# EAGLE design esp8285-router (EAGLE 8.3.2)
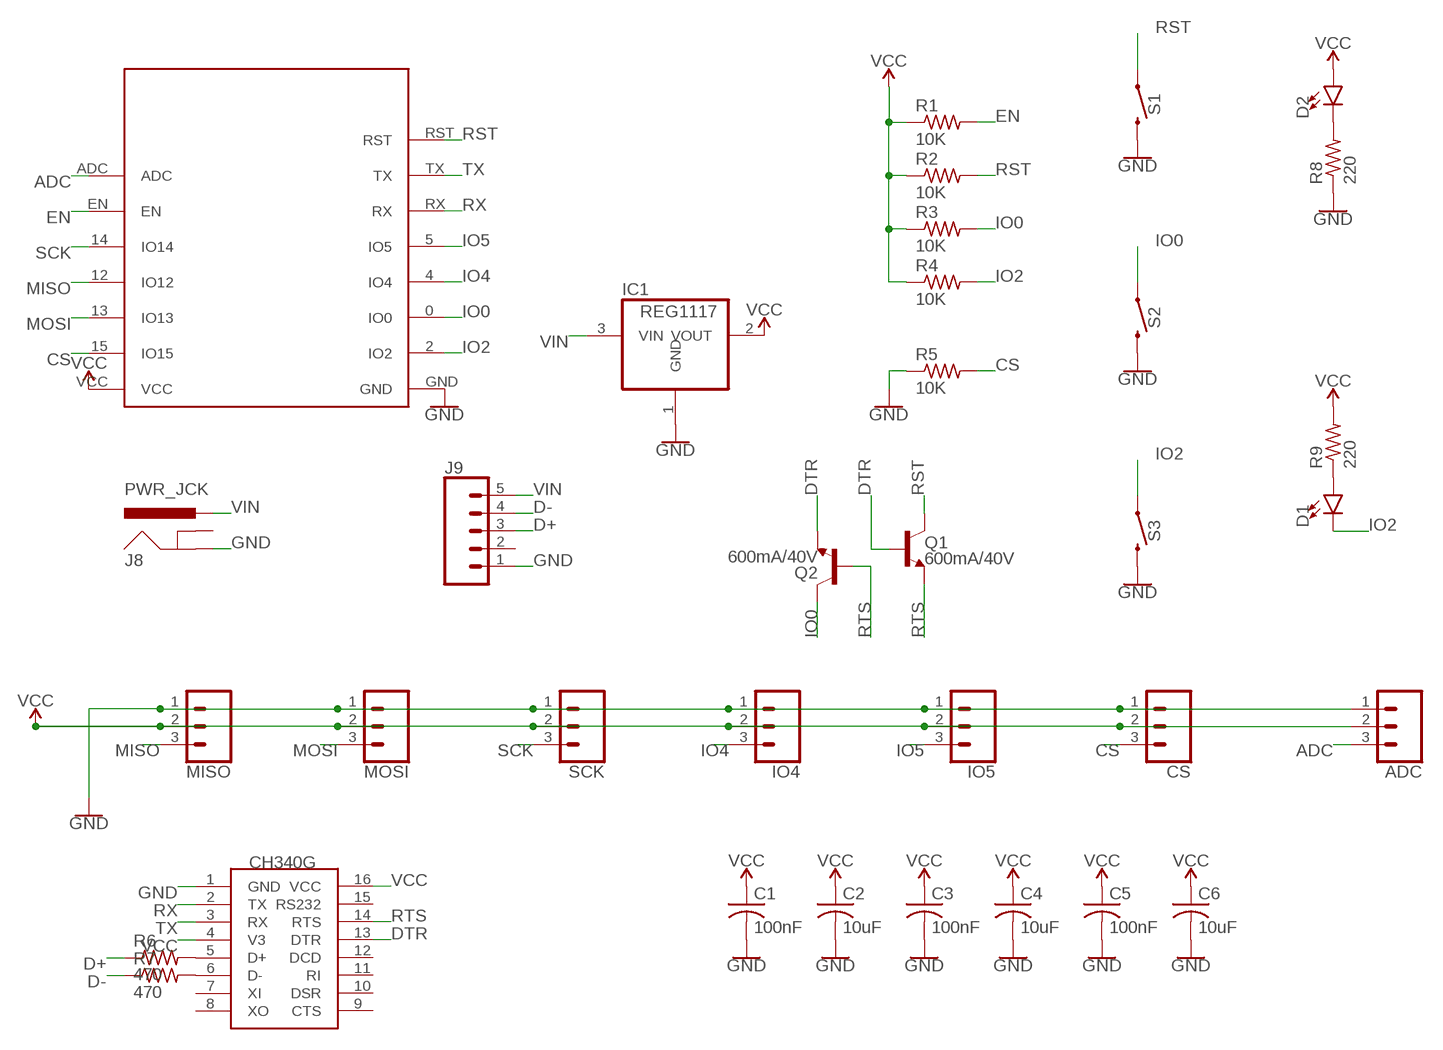
[diagram p0: schematic, sheet 1]

## Parts
ADC  CONN_03  [1X03]
C1  100nF  C-USC1206  [C1206]
C2  10uF  C-USC1206  [C1206]
C3  100nF  C-USC1206  [C1206]
C4  10uF  C-USC1206  [C1206]
C5  100nF  C-USC1206  [C1206]
C6  10uF  C-USC1206  [C1206]
CH340C  CH340C  CH340G  [SOIC16]
CS  CONN_03  [1X03]
D1  LED1206  [LED-1206]
D2  LED1206  [LED-1206]
IC1  REG1117  [SOT223]
IO4  CONN_03  [1X03]
IO5  CONN_03  [1X03]
J8  PWR_JCK  POWER_JACKSLT  [POWER_JACK_SLOT]
J9  CONN_05  [1X05]
MISO  CONN_03  [1X03]
MOSI  CONN_03  [1X03]
Q1  600mA/40V  TRANS_NPN-MMBT2222AL  [SOT23-3]
Q2  600mA/40V  TRANS_NPN-MMBT2222AL  [SOT23-3]
R1  10K  R-US_R1206  [R1206]
R2  10K  R-US_R1206  [R1206]
R3  10K  R-US_R1206  [R1206]
R4  10K  R-US_R1206  [R1206]
R5  10K  R-US_R1206  [R1206]
R6  470  R-US_R1206  [R1206]
R7  470  R-US_R1206  [R1206]
R8  220  R-US_R1206  [R1206]
R9  220  R-US_R1206  [R1206]
S1  MOMENTARY-SWITCH-SPST-PTH-6.0MM  [TACTILE_SWITCH_PTH_6.0MM]
S2  MOMENTARY-SWITCH-SPST-PTH-6.0MM  [TACTILE_SWITCH_PTH_6.0MM]
S3  MOMENTARY-SWITCH-SPST-PTH-6.0MM  [TACTILE_SWITCH_PTH_6.0MM]
SCK  CONN_03  [1X03]
U$1  ESP-M2  [ESP-M2]

## Nets
ADC: ADC.3 U$1.ADC
CS: CS.3 R5.2 U$1.15(IO15)
D+: J9.3 R6.1
D-: J9.4 R7.1
DTR: CH340C.13(DTR) Q1.1(B) Q2.2(E)
EN: R1.2 U$1.EN
GND: ADC.1 C1.2 C2.2 C3.2 C4.2 C5.2 C6.2 CH340C.1(GND) CS.1 IC1.1(GND) IO4.1 IO5.1 J8.GND@2(GND) J9.1 MISO.1 MOSI.1 R5.1 R8.1 S1.3 S2.3 S3.3 SCK.1 U$1.GND
IO0: Q2.3(C) R3.2 S2.1 U$1.0(IO0)
IO2: D1.C R4.2 S3.1 U$1.2(IO2)
IO4: IO4.3 U$1.4(IO4)
IO5: IO5.3 U$1.5(IO5)
MISO: MISO.3 U$1.12(IO12)
MOSI: MOSI.3 U$1.13(IO13)
N$1: CH340C.5(D+) R6.2
N$2: CH340C.6(D-) R7.2
N$5: D1.A R9.1
N$6: D2.C R8.2
RST: Q1.3(C) R2.2 S1.1 U$1.RST
RTS: CH340C.14(RTS) Q1.2(E) Q2.1(B)
RX: CH340C.2(TX) U$1.RX
SCK: SCK.3 U$1.14(IO14)
TX: CH340C.3(RX) U$1.TX
VCC: ADC.2 C1.1 C2.1 C3.1 C4.1 C5.1 C6.1 CH340C.4(V3) CH340C.16(VCC) CS.2 D2.A IC1.2(VOUT) IO4.2 IO5.2 MISO.2 MOSI.2 R1.1 R2.1 R3.1 R4.1 R9.2 SCK.2 U$1.VCC
VIN: IC1.3(VIN) J8.PWR J9.5
Unconnected: CH340C.7(XI) CH340C.8(XO) CH340C.9(CTS) CH340C.10(DSR) CH340C.11(RI) CH340C.12(DCD) CH340C.15(RS232) J8.GND@1(GNDBREAK) J9.2

## Library data of the parts
ADC CS IO4 IO5 MISO MOSI SCK = SparkFun-Connectors:CONN_03: Multi connection point. Often used as Generic Header-pin footprint for 0.1 inch spaced/style header connections On any of the 0.1 inch spaced packages, you can populate with these: Break Away Headers - Straight <https://www.sparkfun.com/products/116> (PRT-00116) Break Away Male Headers - Right Angle <https://www.sparkfun.com/products/553> (PRT-00553) Female Headers <https://www.sparkfun.com/products/115> (PRT-00115) Break Away Headers - Machine Pin <https://www.sparkfun.com/products/117> (PRT-00117) Break Away Female Headers - Swiss Machine Pin <https://www.sparkfun.com/products/743> (PRT-00743) Stackable Header - 3 Pin (Female, 0.1") <https://www.sparkfun.com/products/13875> (PRT-13875) For SCREWTERMINALS and SPRING TERMINALS visit here: Screw Terimnals on SparkFun.com <https://www.sparkfun.com/search/results?term=Screw+Terminals> (5mm/3.5mm/2.54mm spacing) This device is also useful as a general connection point to wire up your design to another part of your project. Our various solder wires solder well into these plated through hole pads. Hook-Up Wire - Assortment (Stranded, 22 AWG) <https://www.sparkfun.com/products/11375> (PRT-11375) Hook-Up Wire - Assortment (Solid Core, 22 AWG) <https://www.sparkfun.com/products/11367> (PRT-11367) View the entire wire category on our website here <https://www.sparkfun.com/categories/141> Special notes: Molex polarized connector foot print use with SKU : PRT-08232 with associated crimp pins and housings.; PROD_ID: XXX-00000; VALUE: 455-1750-1-ND
C1-C6 = resistor:C-US: CAPACITOR, American symbol
CH340C = ch340g:CH340G
D1 D2 = SparkFun-LED:LED: LED (Generic) Standard schematic elements and footprints for 5mm, 3mm, 1206, and 0603 sized LEDs. Generic LEDs with no color specified.
IC1 = burr-brown:REG1117: 800mA and 1A Low Dropout (LDO) Positive Regulator 1.8V, 2.5V, 2.85V, 3.3V, 5V, and Adj; MPN: REG1117; OC_FARNELL: 1097566; OC_NEWARK: 14P6981
J8 = SparkFun-Connectors:POWER_JACK: Power Jack Connector This is the standard 5.5mm barrel jack for power. The PTH is the most common, proven, reliable, footprint. The Slot footprint only works if the mill layer is transmitted to the PCB fab house so be warned. Here are the connectors we sell at SparkFun: DC Barrel Power Jack/Connector <https://www.sparkfun.com/products/119> (PRT-00119) DC Barrel Power Jack/Connector (SMD) <https://www.sparkfun.com/products/12748> (PRT-12748) DC Barrel Jack Adapter - Breadboard Compatible <https://www.sparkfun.com/products/10811> (PRT-10811) It is used on this SparkFun product (and many, many others): SparkFun RedBoard - Programmed with Arduino <https://www.sparkfun.com/products/12757> (DEV-12757) Also, if you need a mating power supply or connector, please check these out: Wall Adapter Power Supply - 9VDC 650mA <https://www.sparkfun.com/products/298> (TOL-00298) DC Barrel Jack Adapter - Male <https://www.sparkfun.com/products/10287> (PRT-10287); PROD_ID: PRT-00119
J9 = SparkFun-Connectors:CONN_05: Multi connection point. Often used as Generic Header-pin footprint for 0.1 inch spaced/style header connections On any of the 0.1 inch spaced packages, you can populate with these: Break Away Headers - Straight <https://www.sparkfun.com/products/116> (PRT-00116) Break Away Male Headers - Right Angle <https://www.sparkfun.com/products/553> (PRT-00553) Female Headers <https://www.sparkfun.com/products/115> (PRT-00115) Break Away Headers - Machine Pin <https://www.sparkfun.com/products/117> (PRT-00117) Break Away Female Headers - Swiss Machine Pin <https://www.sparkfun.com/products/743> (PRT-00743) For SCREWTERMINALS and SPRING TERMINALS visit here: Screw Terimnals on SparkFun.com <https://www.sparkfun.com/search/results?term=Screw+Terminals> (5mm/3.5mm/2.54mm spacing) This device is also useful as a general connection point to wire up your design to another part of your project. Our various solder wires solder well into these plated through hole pads. Hook-Up Wire - Assortment (Stranded, 22 AWG) <https://www.sparkfun.com/products/11375> (PRT-11375) Hook-Up Wire - Assortment (Solid Core, 22 AWG) <https://www.sparkfun.com/products/11367> (PRT-11367) View the entire wire category on our website here <https://www.sparkfun.com/categories/141> Special notes: Molex polarized connector foot print use with SKU : PRT-08231 with associated crimp pins and housings. 1MM SMD Version SKU: PRT-10208
Q1 Q2 = SparkFun-DiscreteSemi:TRANS_NPN: NPN transistor Current controlled devices typically used to amplify current or used as a switch. BC547 - COM-08928 <http://www.sparkfun.com/products/8928> (TO-92 45V 100mA) (1.Collector 2.Base 3.Emitter) 2N3904 - COM-00521 <http://www.sparkfun.com/products/521> (TO-92 40V 200mA) (1.Emitter 2.Base 3.Collector) P2N2222A - COM-12852 <http://www.sparkfun.com/products/12852> (TO-92 40V 600mA) (1.Collector 2.Base 3.Emitter); PROD_ID: TRANS-08049
R1-R9 = resistor:R-US_: RESISTOR, American symbol
S1-S3 = SparkFun-Switches:MOMENTARY-SWITCH-SPST: Momentary Switch (Pushbutton) - SPST Normally-open (NO) SPST momentary switches (buttons, pushbuttons). Variants PTH-12MM - 12mm square, through-hole Momentary Pushbutton Switch - 12mm Square <https://www.sparkfun.com/products/9190> (COM-09190) PTH-6.0MM, PTH-6.0MM-KIT - 6.0mm square, through-hole Mini Pushbutton Switch <https://www.sparkfun.com/products/97> (COM-00097) KIT package intended for soldering kit's - only one side of pads' copper is exposed. PTH-RIGHT-ANGLE-KIT - Right-angle, through-hole Right Angle Tactile Button <https://www.sparkfun.com/products/10791> - Used on SparkFun BigTime Watch Kit <https://www.sparkfun.com/products/11734> SMD-12MM - 12mm square, surface-mount Tactile Button - SMD (12mm) <https://www.sparkfun.com/products/12993> (COM-12993) Used on SparkFun PicoBoard <https://www.sparkfun.com/products/11888> SMD-4.5MM - 4.5mm Square Trackball Switch Used on SparkFun Blackberry Trackballer Breakout <https://www.sparkfun.com/products/13169> SMD-4.6MMX2.8MM - 4.60mm x 2.80mm, surface mount Used on SparkFun SAMD21 Mini Breakout <https://www.sparkfun.com/products/13664> SMD-5.2MM, SMD-5.2-REDUNDANT - 5.2mm square, surface-mount Mini Pushbutton Switch - SMD <https://www.sparkfun.com/products/8720> (COM-08720) Used on Arduino Pro Mini <https://www.sparkfun.com/products/11114> REDUNDANT package connects both switch circuits together SMD-6.0X3.5MM - 6.0 x 3.5mm, surface mount Momentary Reset Switch SMD <https://www.sparkfun.com/products/8229> (COM-08229) SMD-6.2MM-TALL - 6.2mm square, surface mount Tactile Button - SMD (6mm) <https://www.sparkfun.com/products/12992> Used on SparkFun Digital Sandbox <https://www.sparkfun.com/products/12651> SMD-RIGHT-ANGLE - Right-angle, surface mount Used on SparkFun Block for Intel® Edison - Arduino <https://www.sparkfun.com/products/13036>; PROD_ID: SWCH-08441; SF_SKU: COM-00097
U$1 = esp8266modules:ESP-M2: ESP8285 Module - M2

## Board
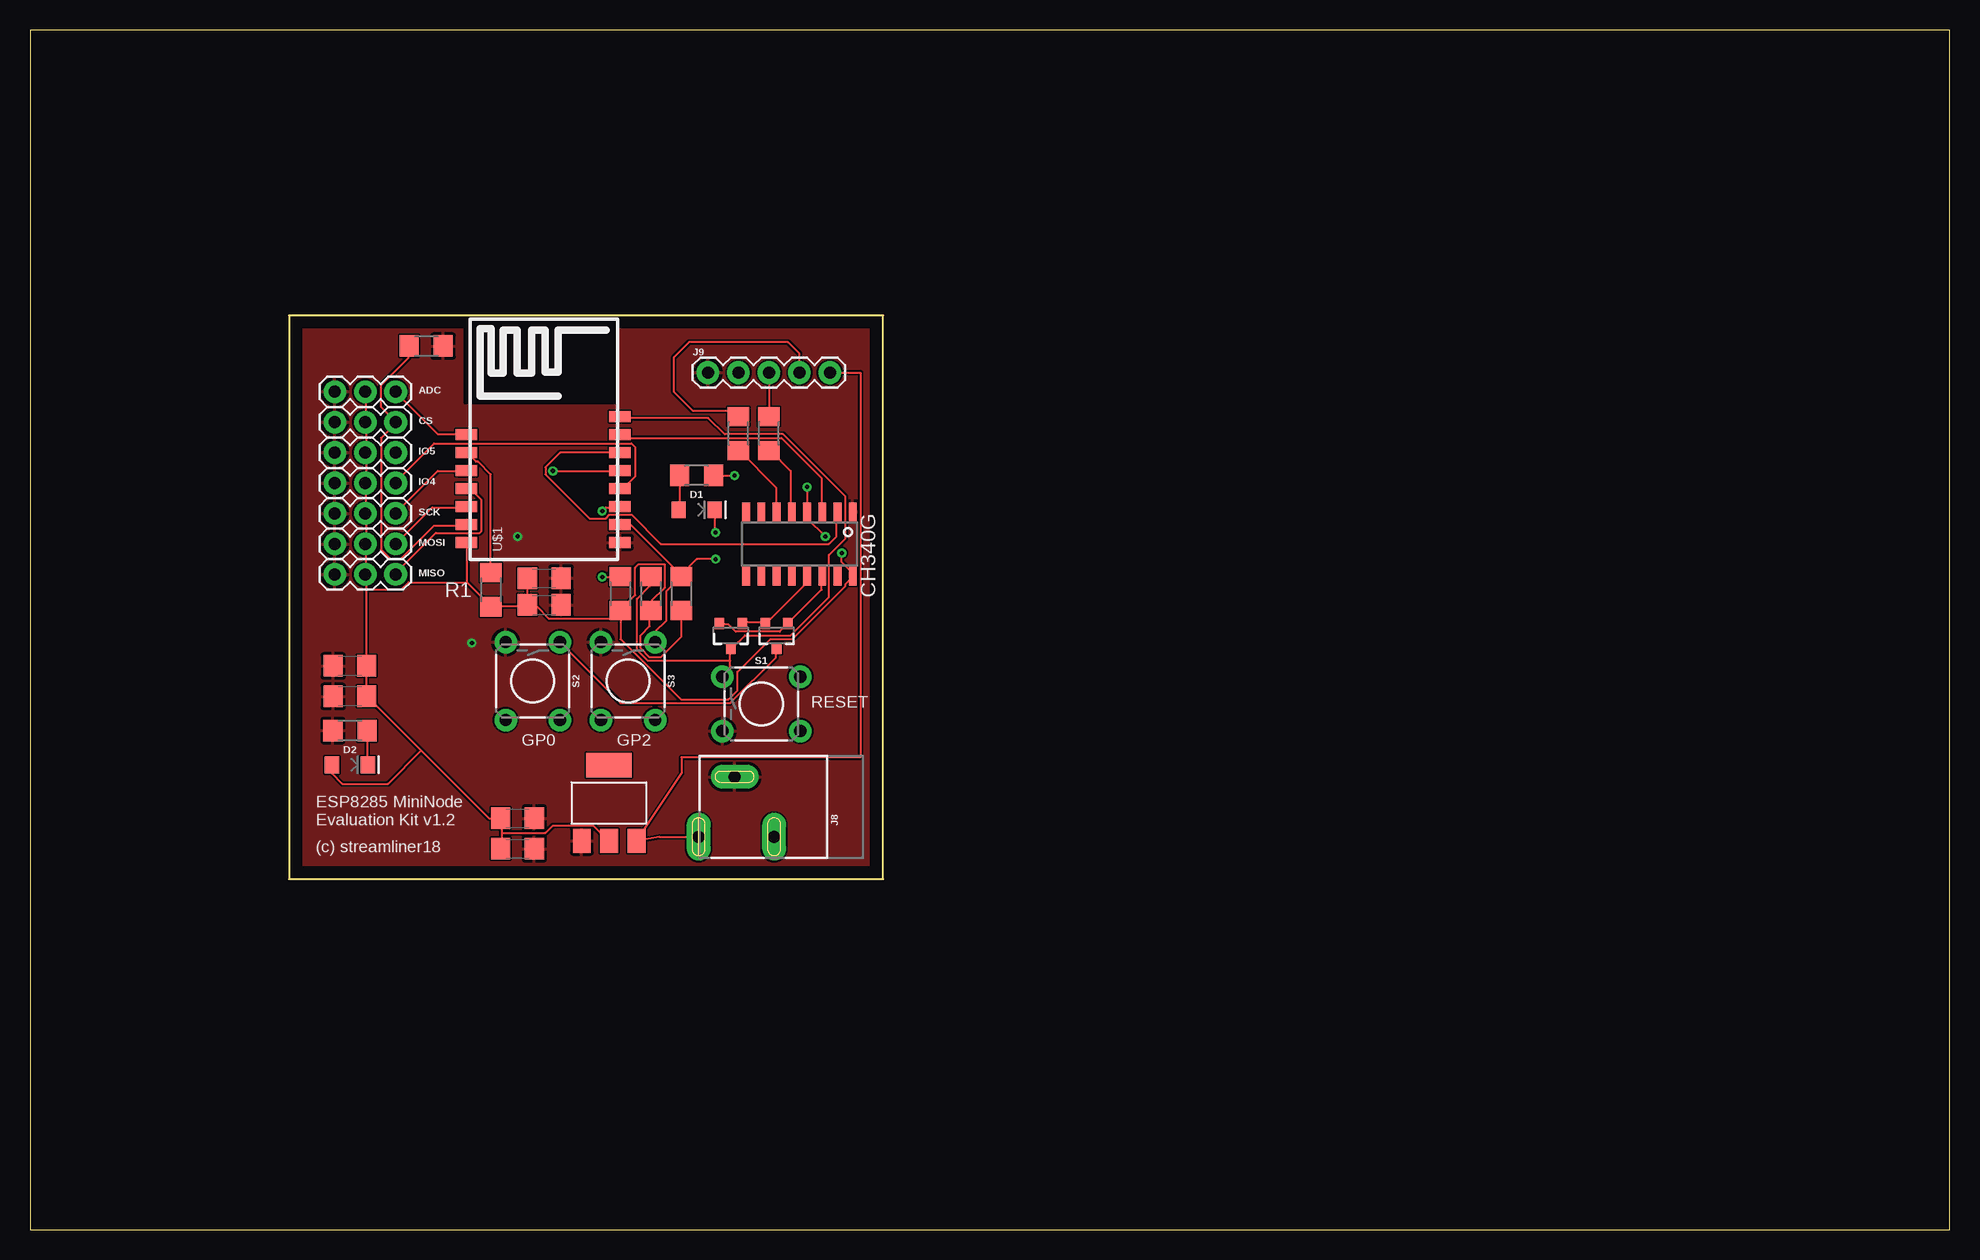
[diagram p1: board, top side]
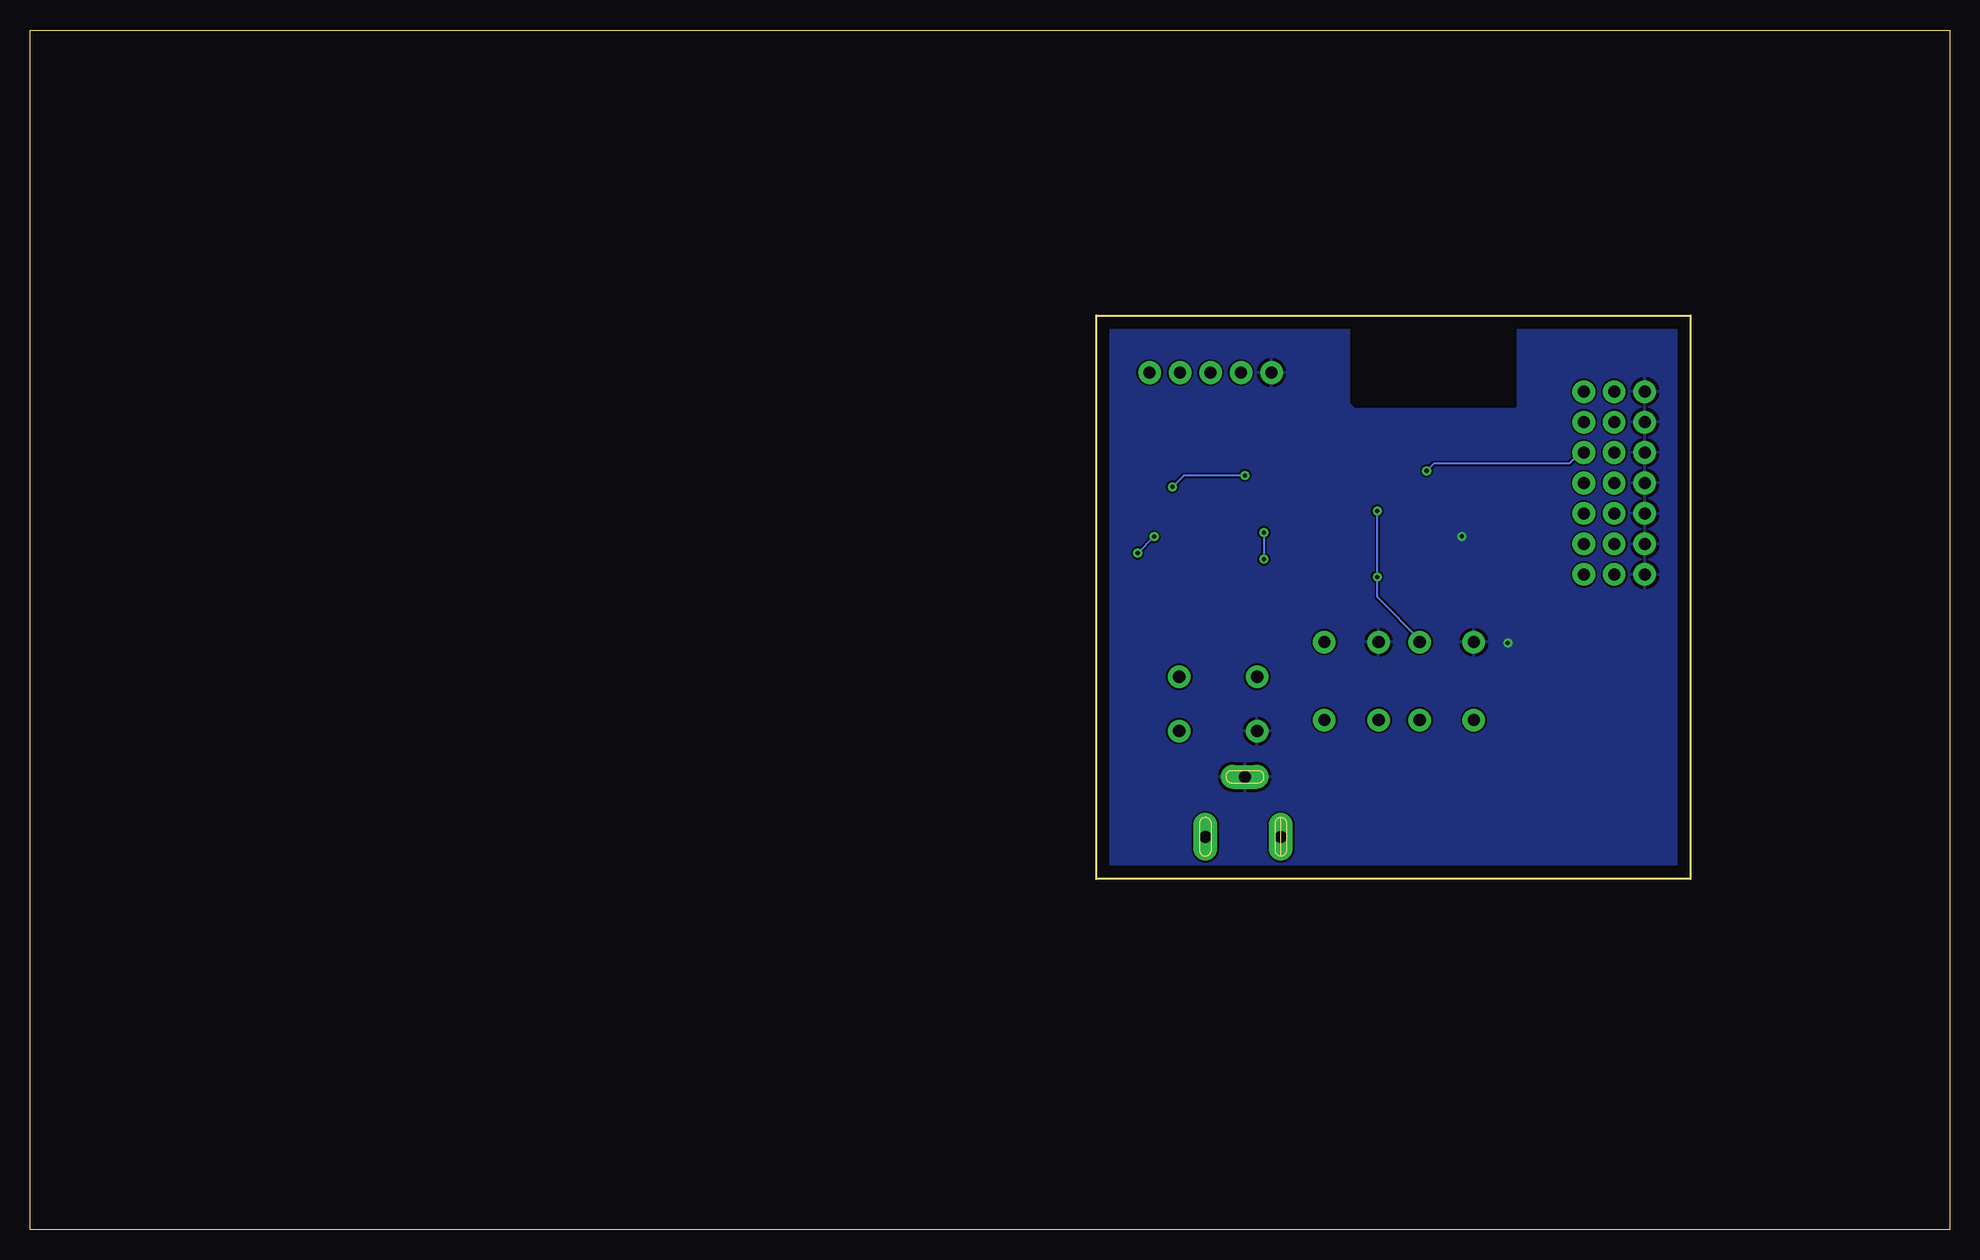
[diagram p2: board, bottom side, seen from below]

Size 160 x 100 mm. Coordinates in mm from the lower left corner, seen from the top.
Outline: 0,0 160,0 160,100 0,100 0,0
Outline: 21.59,76.2 21.59,29.21 71.12,29.21 71.12,76.2 21.59,76.2
Copper layers (1*16): Top 0.035mm / dielectric 1.5mm / Bottom 0.035mm
Design rules "default": minimum track width 6mil, minimum drill 0.35mm, track to track 6mil, track to pad 6mil, pad to pad 6mil, via to via 6mil, smd to smd 6mil, copper to edge 40mil, drill to drill 6mil, minimum pad ring 10mil, minimum via ring 8mil, stop-mask expansion 4mil, vias tented up to drill 0mil, thermal gap 10mil

### Footprints (pad centres in the part's own frame; a part is rotated, then mirrored left to right if it is on the bottom)
1X03 = drill 1.016 pad 1.88: 1 0,0; 2 2.54,0; 3 5.08,0
C1206 = smd 1.6 x 1.8: 1 -1.4,0; 2 1.4,0
SOIC16 = smd 0.635 x 1.524: 1 -4.445,-2.695; 2 -3.175,-2.695; 3 -1.905,-2.695; 4 -0.635,-2.695; 5 0.635,-2.695; 6 1.905,-2.695; 7 3.175,-2.695; 8 4.445,-2.695; 9 4.445,2.695; 10 3.175,2.695; 11 1.905,2.695; 12 0.635,2.695; 13 -0.635,2.695; 14 -1.905,2.695; 15 -3.175,2.695; 16 -4.445,2.695
LED-1206 = smd 1.2 x 1.4: A -1.5,0; C 1.5,0
SOT223 = smd 1.499 x 2.007: 1 -2.261,-3.15; 2 0.025,-3.15; 3 2.311,-3.15 | smd 3.81 x 2.007: 4 0,3.15
POWER_JACK_SLOT = drill 1 pad 2 long: GND@1 2.58,7.5; GND@2 7.58,10.8; PWR 2.58,13.8
1X05 = drill 1.016 pad 1.88: 1 0,0; 2 2.54,0; 3 5.08,0; 4 7.62,0; 5 10.16,0
SOT23-3 = smd 0.8 x 0.9: 1 -0.95,-1; 2 0.95,-1; 3 0,1.1
R1206 = smd 1.6 x 1.803: 1 -1.422,0; 2 1.422,0
TACTILE_SWITCH_PTH_6.0MM = drill 1.016 pad 1.88: 1 -3.251,2.261; 2 3.251,2.261; 3 -3.251,-2.261; 4 3.251,-2.261
ESP-M2 = smd 1.778 x 0.914: 0 6,-6.4; 2 6,-7.9; 4 6,-4.9; 5 6,-3.4; 12 -6.8,-4.9; 13 -6.8,-6.4; 14 -6.8,-3.4; 15 -6.8,-7.9; ADC -6.8,-0.4; EN -6.8,-1.9; GND 6,-9.4; RST 6,1.1; RX 6,-1.9; TX 6,-0.4; VCC -6.8,-9.4

### Placement (x,y rotation side)
ADC  25.4,69.85 0 top
C1  42.86,54.29 0 top
C2  42.86,52.07 0 top
C3  26.67,44.45 180 top
C4  26.67,46.99 180 top
C5  40.64,34.29 0 top
C6  40.64,31.75 0 top
CH340C  64.14,57.15 180 top
CS  25.4,67.31 0 top
D1  55.56,60.01 0 top
D2  26.67,38.73 0 top
IC1  48.26,35.56 0 top
IO4  25.4,62.23 0 top
IO5  25.4,64.77 0 top
J8  69.53,30.16 90 top
J9  56.52,71.44 0 top
MISO  25.4,54.61 0 top
MOSI  25.4,57.15 0 top
Q1  58.42,49.53 180 top
Q2  62.23,49.53 180 top
R1  38.42,53.34 90 top
R2  51.75,53.02 90 top
R3  49.21,53.02 90 top
R4  54.29,53.02 90 top
R5  33.02,73.66 180 top
R6  61.59,66.36 270 top
R7  59.05,66.36 270 top
R8  26.67,41.59 0 top
R9  55.56,62.87 0 top
S1  60.96,43.81 0 top
S2  41.91,45.72 270 top
S3  49.85,45.72 270 top
SCK  25.4,59.69 0 top
U$1  43.18,66.67 0 top

### Tracks (layer width: path | path; a pad name or v marks a point on that pad's centre or on a via)
ADC
  Top 0.152: U$1.ADC 36.27,66.29 33.98,66.29 30.48,69.8 ADC.3
CS
  Top 0.152: U$1.15 36.27,58.67 33.68,58.67 30.94,55.93 30.02,55.93 29.26,56.69 29.26,65.99 30.48,67.21 CS.3 30.48,67.36 29.26,68.58 29.26,70.41 31.55,72.69 31.55,73.61 R5.2
D+
  Top 0.152: J9.3 R6.1
D-
  Top 0.152: J9.4 64.14,73.03 63.18,73.98 54.93,73.98 53.66,72.71 53.66,69.85 55.24,68.26 58.57,68.26 R7.1
DTR
  Top 0.152: Q1.1 59.44,50.6 61.27,50.6 Q2.2 61.42,50.6 64.77,53.95 CH340C.13
EN
  Top 0.152: U$1.EN 36.42,64.77 37.19,64.01 37.34,64.01 38.41,62.94 38.41,54.86 R1.2
GND  (via drill 0.35)
  other vias: 40.64,57.78 36.83,48.9
  pour Bottom: 19.05,78.42 19.05,26.67 73.34,26.67 73.66,26.99 73.66,77.79 19.68,77.79
  pour Top: 14.61,80.96 14.61,22.23 79.69,22.23 80.01,22.54 80.01,80.64 79.69,80.96 14.92,80.96 14.61,81.28
IO0  (via drill 0.35)
  Top 0.152: Q2.3 62.18,48.31 62.18,47.7 58.37,43.89 49.23,43.89 44.2,48.92 S2.1 | v47.7,59.89 48.01,60.2 49.07,60.2 U$1.0 | v47.7,54.41 49.07,54.41 R3.2
  Bottom 0.152: v47.7,59.89 v47.7,54.41 47.7,52.73 44.04,49.07 S2.1
IO2  (via drill 0.35)
  Top 0.152: 54.25,54.56 50.14,58.67 49.23,58.67 U$1.2 | 54.25,54.56 R4.2 54.25,54.41 53.03,53.19 53.03,50.75 52.12,49.84 52.12,49.07 S3.1 | D1.C 57.06,58.19 v57.15,58.1 | v57.15,55.88 55.58,55.88 54.25,54.56
  Bottom 0.152: v57.15,58.1 v57.15,55.88
IO4
  Top 0.152: U$1.4 49.23,61.87 49.53,61.87 50.44,62.79 50.44,65.23 50.14,65.53 33.68,65.53 30.48,62.33 IO4.3
IO5  (via drill 0.35)
  Top 0.152: v43.59,63.25 49.07,63.25 U$1.5
  Bottom 0.152: v43.59,63.25 42.98,63.86 31.7,63.86 30.79,64.77 IO5.3
MISO
  Top 0.152: U$1.12 36.42,61.72 36.73,61.72 37.64,60.81 37.64,58.22 37.49,58.06 33.83,58.06 30.48,54.71 MISO.3
MOSI
  Top 0.152: MOSI.3 33.53,60.2 36.27,60.2 U$1.13
N$1
  Top 0.152: CH340C.5 63.4,59.89 63.4,63.25 61.72,64.92 R6.2
N$2
  Top 0.152: CH340C.6 62.18,59.89 62.18,61.87 59.13,64.92 R7.2
N$3
  cutout Top: 36.2,76.2 36.2,68.9 48.9,68.9 48.9,76.2
N$4
  cutout Bottom: 36.2,76.2 36.2,68.58 49.53,68.58 49.85,68.9 49.85,76.2
N$5
  Top 0.152: R9.1 54.14,60.09 D1.A
N$6
  Top 0.152: R8.2 28.09,38.81 D2.C
RST
  Top 0.152: 58.37,46.18 58.37,46.99 | 58.37,46.99 58.37,47.4 | 58.37,47.4 58.37,48.31 Q1.3 58.52,48.46 59.59,49.53 63.4,49.53 66.6,52.73 66.6,56.24 67.97,57.61 67.97,61.11 62.79,66.29 57.91,66.29 56.54,67.67 49.23,67.67 U$1.RST | 58.37,47.4 51.51,47.4 50.6,48.31 50.6,52.58 51.66,53.65 51.66,54.41 R2.2 | 58.37,46.99 58.37,46.74 S1.1
RTS
  Top 0.152: Q1.2 57.61,50.44 58.22,50.44 58.83,49.84 62.48,49.84 63.09,50.44 Q2.1 63.25,50.6 65.99,53.34 65.99,54.41 CH340C.14
RX
  Top 0.152: CH340C.2 67.21,59.74 67.21,57.76 66.6,57.15 52.58,57.15 50.14,59.59 48.31,59.59 48.01,59.28 46.63,59.28 42.98,62.94 42.98,63.55 44.2,64.77 49.07,64.77 U$1.RX
SCK
  Top 0.152: U$1.14 36.27,63.25 33.98,63.25 30.48,59.74 SCK.3
TX
  Top 0.152: CH340C.3 65.99,59.89 65.99,62.64 62.64,65.99 49.38,65.99 49.23,66.14 U$1.TX
VCC  (via drill 0.35)
  Top 0.152: C2.1 41.45,52.12 41.45,54.25 C1.1 | 36.42,53.95 36.42,57.15 U$1.VCC | 36.42,53.95 38.41,51.97 R1.1 38.56,51.97 41.45,51.97 C2.1 | R4.1 54.25,51.51 54.25,49.38 52.58,47.7 51.66,47.7 50.9,48.46 50.9,49.53 51.66,50.29 51.66,51.51 R2.1 51.82,51.66 51.82,52.43 52.88,53.49 52.88,55.47 50.75,55.47 50.44,55.17 50.44,52.88 49.23,51.66 R3.1 | 49.23,50.9 49.23,51.51 R3.1 | 49.23,50.9 49.23,49.23 54.25,44.2 58.22,44.2 58.98,44.96 58.98,46.48 61.72,49.23 63.55,49.23 67.97,53.65 67.97,53.8 68.58,54.41 CH340C.16 68.58,54.71 67.67,55.63 v67.67,56.39 | v66.29,57.76 64.77,59.28 CH340C.4 v64.77,61.91 | 49.23,50.9 43.28,50.9 42.22,51.97 41.6,51.97 C2.1 | 49.23,50.9 R3.1 | 28.04,57.15 28.04,59.59 SCK.2 28.04,59.74 28.04,62.18 IO4.2 28.04,62.33 28.04,64.77 | 28.04,64.77 28.04,67.21 CS.2 28.04,67.36 28.04,69.8 ADC.2 | 28.04,64.77 IO5.2 | 39.32,33.07 39.32,34.29 C5.1 38.25,34.29 32.62,39.92 | 39.32,33.07 39.32,31.85 C6.1 | 39.32,33.07 42.98,33.07 43.59,33.68 46.94,33.68 48.16,32.46 IC1.2 | 28.04,53.34 28.04,54.56 MISO.2 28.04,54.71 28.04,57.15 | 28.04,53.34 28.04,47.09 C4.1 28.04,46.94 28.04,44.5 C3.1 28.19,44.35 32.62,39.92 | 28.04,57.15 MOSI.2 | 36.42,53.95 31.55,53.95 30.94,53.34 28.04,53.34 | D2.A 25.17,38.01 26.04,37.15 29.84,37.15 32.62,39.92 | R9.2 v58.74,62.87
  Bottom 0.152: v67.67,56.39 v66.29,57.76 | v58.74,62.87 63.82,62.87 v64.77,61.91
VIN
  Top 0.152: J8.PWR 52.46,32.74 IC1.3 54.29,38.04 54.29,39.37 69.22,39.37 69.22,71.44 J9.5

### Text on the board
tNames: RESET | GP0 | GP2 | ESP8285 MiniNode / Evaluation Kit v1.2 | (c) streamliner18
tDocu: G + S